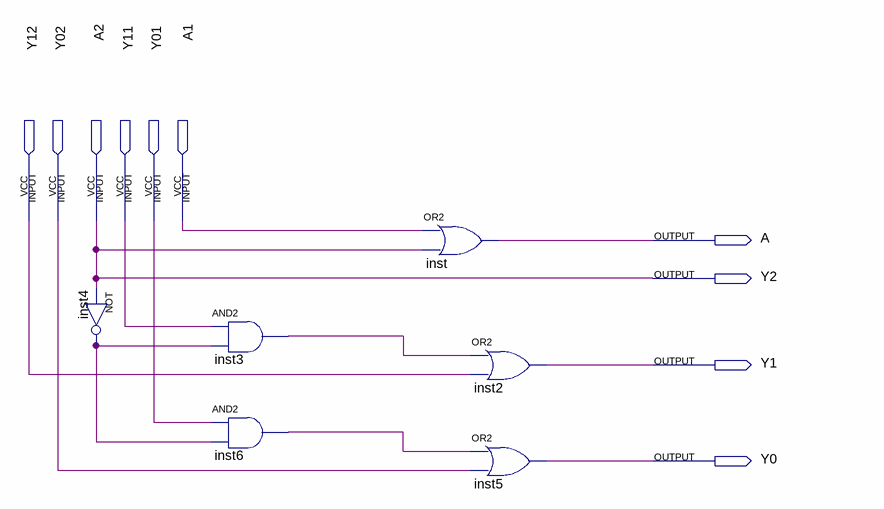
[diagram p0: schematic sheet]
// Quartus schematic q5.bdf as structural Verilog: 6 symbols, 10 pins
module q5 (
  input  Y12,
  input  Y02,
  input  A2,
  input  Y11,
  input  Y01,
  input  A1,
  output A,
  output Y2,
  output Y1,
  output Y0
);

  wire inst3_out, inst4_out, inst6_out;

  not inst4 (inst4_out, A2);
  and inst3 (inst3_out, Y11, inst4_out);
  and inst6 (inst6_out, Y01, inst4_out);
  or inst (A, A1, A2);
  or inst2 (Y1, inst3_out, Y12);
  or inst5 (Y0, inst6_out, Y02);

  assign Y2 = A2;
endmodule
